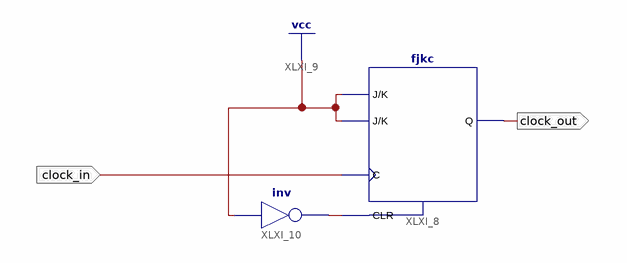
[diagram p0: schematic sheet 1]
// Xilinx ISE schematic div2.sch (spartan6) as structural Verilog: 2 symbols, 2 ports
module div2 (
  input  clock_in,
  output clock_out
);

  wire XLXN_18;

  fjkc XLXI_8 (.C(clock_in), .CLR(XLXN_18), .J(1'b1), .K(1'b1), .Q(clock_out));
  not XLXI_10 (XLXN_18, 1'b1);
endmodule
